# EAGLE design 16n_13 (EAGLE 9.1.3)

## Sheet 1 of 2: Faders / Jacks / Digital
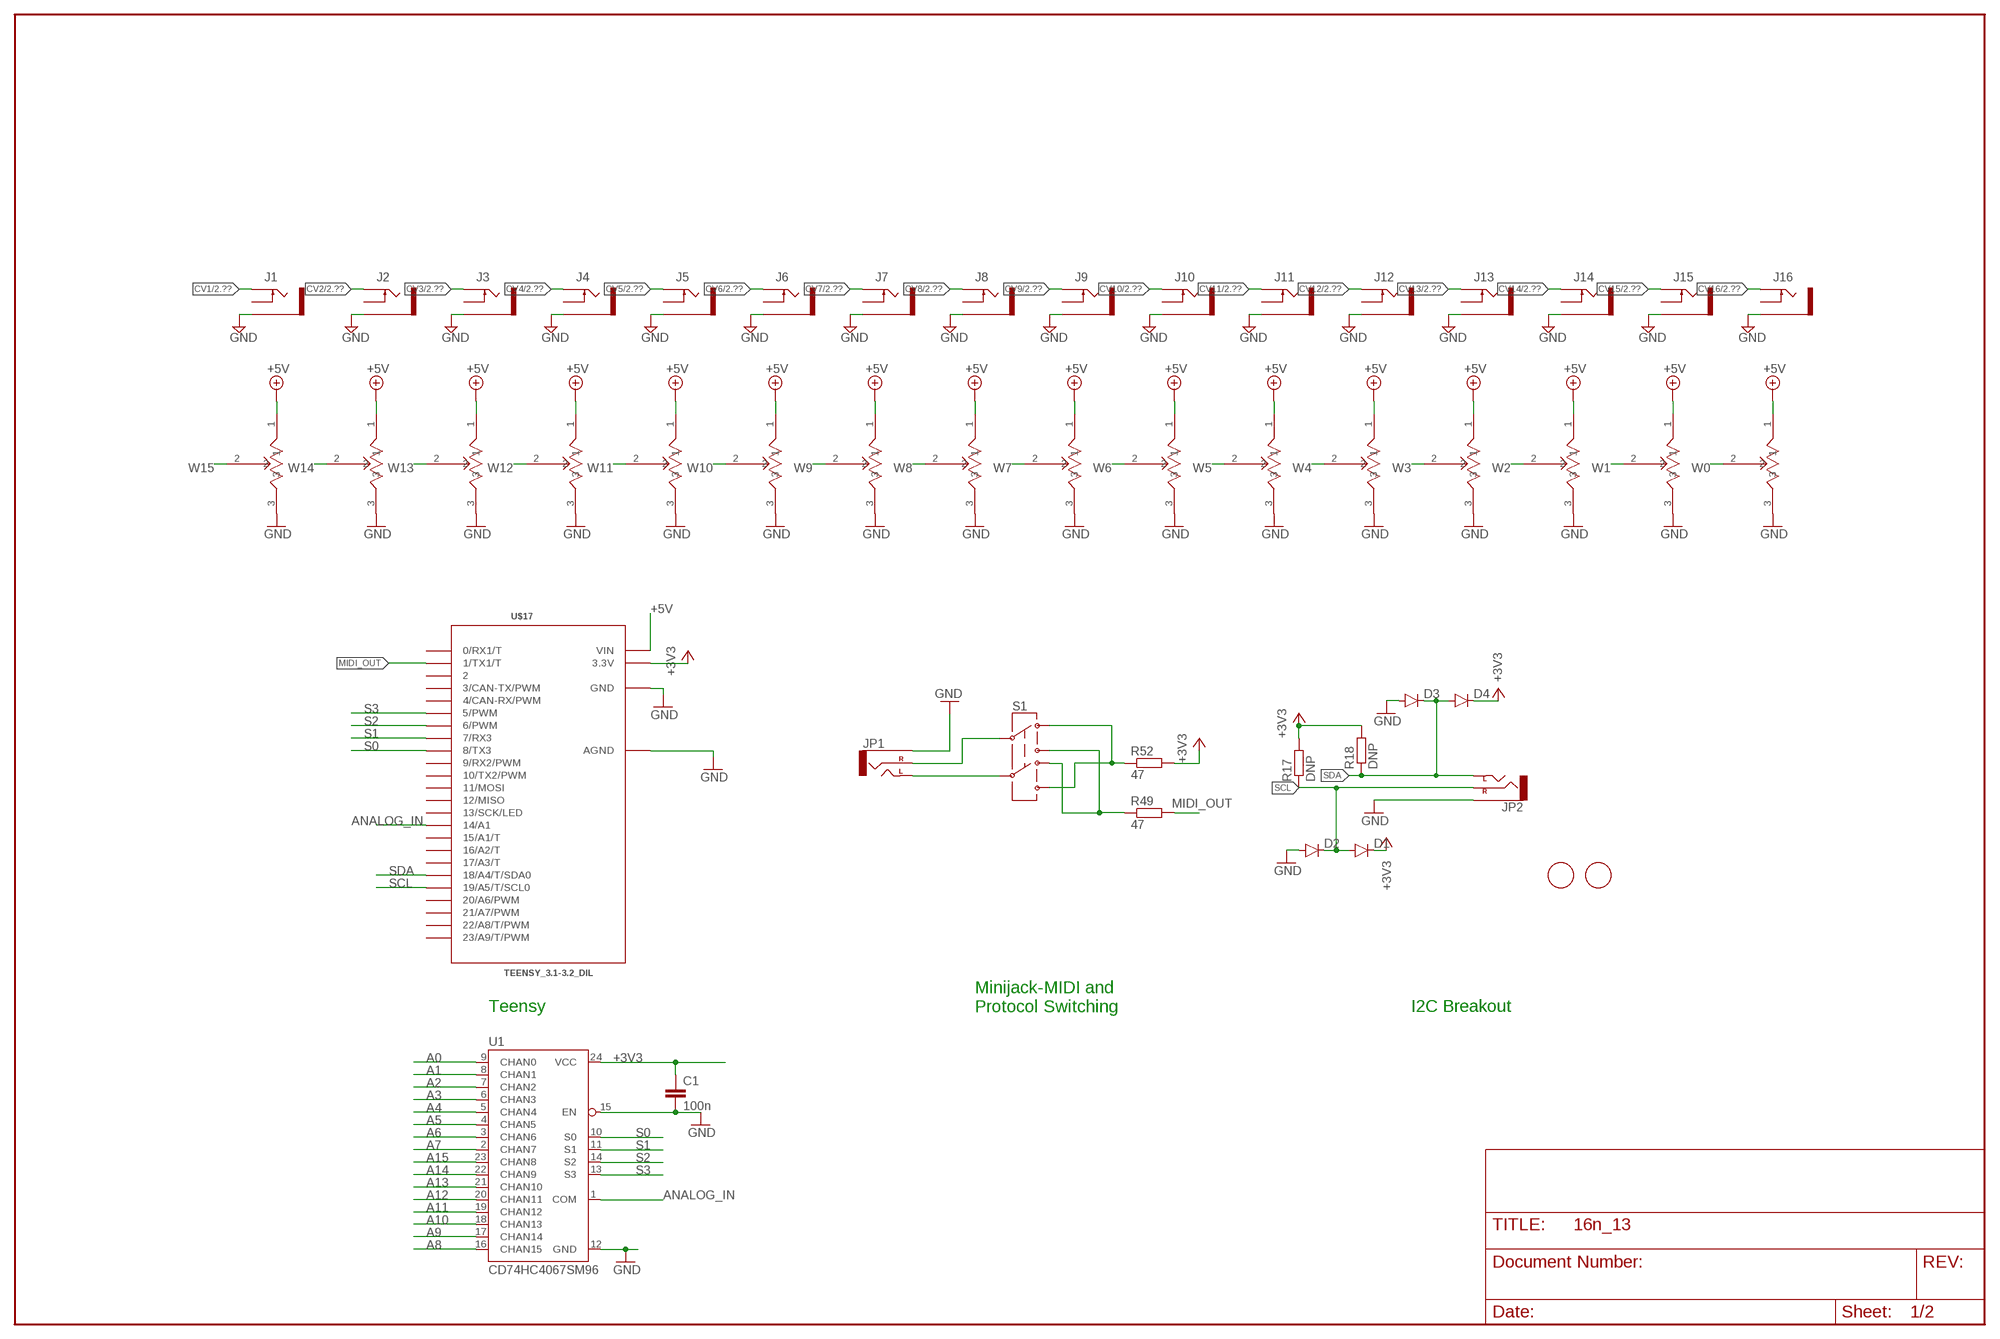
[diagram p0: schematic, sheet 1]

### Parts
C1  100n  C-EUC0805  [C0805]
D1  DIODESOD123  [SOD-123]
D2  DIODESOD123  [SOD-123]
D3  DIODESOD123  [SOD-123]
D4  DIODESOD123  [SOD-123]
FID1  FIDUCIAL  [FIDUCIAL_1MM]
FID2  FIDUCIAL  [FIDUCIAL_1MM]
J1  PJ302M  [PJ302M]
J2  PJ302M  [PJ302M]
J3  PJ302M  [PJ302M]
J4  PJ302M  [PJ302M]
J5  PJ302M  [PJ302M]
J6  PJ302M  [PJ302M]
J7  PJ302M  [PJ302M]
J8  PJ302M  [PJ302M]
J9  PJ302M  [PJ302M]
J10  PJ302M  [PJ302M]
J11  PJ302M  [PJ302M]
J12  PJ302M  [PJ302M]
J13  PJ302M  [PJ302M]
J14  PJ302M  [PJ302M]
J15  PJ302M  [PJ302M]
J16  PJ302M  [PJ302M]
JP1  AUDIO-JACKPTH  [AUDIO-JACK]
JP2  AUDIO-JACKPTH  [AUDIO-JACK]
R17  DNP  R-EU_R0805  [R0805]
R18  DNP  R-EU_R0805  [R0805]
R49  47  R-EU_R0805  [R0805]
R52  47  R-EU_R0805  [R0805]
S1  SWITCH-DPDTEG2211  [EG2211]
U1  CD74HC4067SM96  744067SO24  [SOIC127P1030X265-24]
U$1  SLIDEPOT-ALPS-60MM  [RS6011SP600]
U$2  SLIDEPOT-ALPS-60MM  [RS6011SP600]
U$3  SLIDEPOT-ALPS-60MM  [RS6011SP600]
U$4  SLIDEPOT-ALPS-60MM  [RS6011SP600]
U$5  SLIDEPOT-ALPS-60MM  [RS6011SP600]
U$6  SLIDEPOT-ALPS-60MM  [RS6011SP600]
U$7  SLIDEPOT-ALPS-60MM  [RS6011SP600]
U$8  SLIDEPOT-ALPS-60MM  [RS6011SP600]
U$9  SLIDEPOT-ALPS-60MM  [RS6011SP600]
U$10  SLIDEPOT-ALPS-60MM  [RS6011SP600]
U$11  SLIDEPOT-ALPS-60MM  [RS6011SP600]
U$12  SLIDEPOT-ALPS-60MM  [RS6011SP600]
U$13  SLIDEPOT-ALPS-60MM  [RS6011SP600]
U$14  SLIDEPOT-ALPS-60MM  [RS6011SP600]
U$15  SLIDEPOT-ALPS-60MM  [RS6011SP600]
U$16  SLIDEPOT-ALPS-60MM  [RS6011SP600]
U$17  TEENSY_3.1-3.2_DIL  [TEENSY_3.0-3.2&LC_DIL]

### Nets
+3V3: C1.1 D1.C D4.C R17.2 R18.2 R52.2 U1.24(VCC) U$17.3.3V
+5V: U$1.1 U$2.1 U$3.1 U$4.1 U$5.1 U$6.1 U$7.1 U$8.1 U$9.1 U$10.1 U$11.1 U$12.1 U$13.1 U$14.1 U$15.1 U$16.1 U$17.VIN ; also sheet 2
A0: U1.9(CHAN0) ; also sheet 2
A1: U1.8(CHAN1) ; also sheet 2
A2: U1.7(CHAN2) ; also sheet 2
A3: U1.6(CHAN3) ; also sheet 2
A4: U1.5(CHAN4) ; also sheet 2
A5: U1.4(CHAN5) ; also sheet 2
A6: U1.3(CHAN6) ; also sheet 2
A7: U1.2(CHAN7) ; also sheet 2
A8: U1.16(CHAN15) ; also sheet 2
A9: U1.17(CHAN14) ; also sheet 2
A10: U1.18(CHAN13) ; also sheet 2
A11: U1.19(CHAN12) ; also sheet 2
A12: U1.20(CHAN11) ; also sheet 2
A13: U1.21(CHAN10) ; also sheet 2
A14: U1.22(CHAN9) ; also sheet 2
A15: U1.23(CHAN8) ; also sheet 2
ANALOG_IN: U1.1(COM) U$17.14/A0(14/A1)
CV1: J1.TIP ; also sheet 2
CV2: J2.TIP ; also sheet 2
CV3: J3.TIP ; also sheet 2
CV4: J4.TIP ; also sheet 2
CV5: J5.TIP ; also sheet 2
CV6: J6.TIP ; also sheet 2
CV7: J7.TIP ; also sheet 2
CV8: J8.TIP ; also sheet 2
CV9: J9.TIP ; also sheet 2
CV10: J10.TIP ; also sheet 2
CV11: J11.TIP ; also sheet 2
CV12: J12.TIP ; also sheet 2
CV13: J13.TIP ; also sheet 2
CV14: J14.TIP ; also sheet 2
CV15: J15.TIP ; also sheet 2
CV16: J16.TIP ; also sheet 2
GND: C1.2 D2.A D3.A J1.GND(SLEEVE) J2.GND(SLEEVE) J3.GND(SLEEVE) J4.GND(SLEEVE) J5.GND(SLEEVE) J6.GND(SLEEVE) J7.GND(SLEEVE) J8.GND(SLEEVE) J9.GND(SLEEVE) J10.GND(SLEEVE) J11.GND(SLEEVE) J12.GND(SLEEVE) J13.GND(SLEEVE) J14.GND(SLEEVE) J15.GND(SLEEVE) J16.GND(SLEEVE) JP1.SLEEVE JP2.SLEEVE U1.12(GND) U1.15(EN) U$1.3 U$2.3 U$3.3 U$4.3 U$5.3 U$6.3 U$7.3 U$8.3 U$9.3 U$10.3 U$11.3 U$12.3 U$13.3 U$14.3 U$15.3 U$16.3 U$17.AGND U$17.GND ; also sheet 2
MIDI_OUT: R49.2 U$17.1(1/TX1/T)
N$1: JP1.TIP(LEFT) S1.P2
N$2: JP1.RING(RIGHT) S1.P1
N$3: R49.1 S1.P1-TB S1.P2-TA
N$4: R52.1 S1.P1-TA S1.P2-TB
S0: U1.10(S0) U$17.8(8/TX3)
S1: U1.11(S1) U$17.7(7/RX3)
S2: U1.14(S2) U$17.6(6/PWM)
S3: U1.13(S3) U$17.5(5/PWM)
SCL: D1.A D2.C JP2.RING(RIGHT) R17.1 U$17.19/A5(19/A5/T/SCL0)
SDA: D3.C D4.A JP2.TIP(LEFT) R18.1 U$17.18/A4(18/A4/T/SDA0)
W0: U$1.2 ; also sheet 2
W1: U$2.2 ; also sheet 2
W2: U$3.2 ; also sheet 2
W3: U$4.2 ; also sheet 2
W4: U$5.2 ; also sheet 2
W5: U$6.2 ; also sheet 2
W6: U$7.2 ; also sheet 2
W7: U$8.2 ; also sheet 2
W8: U$9.2 ; also sheet 2
W9: U$10.2 ; also sheet 2
W10: U$11.2 ; also sheet 2
W11: U$12.2 ; also sheet 2
W12: U$13.2 ; also sheet 2
W13: U$14.2 ; also sheet 2
W14: U$15.2 ; also sheet 2
W15: U$16.2 ; also sheet 2
Unconnected: J1.SW(SWITCH) J2.SW(SWITCH) J3.SW(SWITCH) J4.SW(SWITCH) J5.SW(SWITCH) J6.SW(SWITCH) J7.SW(SWITCH) J8.SW(SWITCH) J9.SW(SWITCH) J10.SW(SWITCH) J11.SW(SWITCH) J12.SW(SWITCH) J13.SW(SWITCH) J14.SW(SWITCH) J15.SW(SWITCH) J16.SW(SWITCH) U$17.0(0/RX1/T) U$17.2 U$17.3(3/CAN-TX/PWM) U$17.4(4/CAN-RX/PWM) U$17.9(9/RX2/PWM) U$17.10(10/TX2/PWM) U$17.11(11/MOSI) U$17.12(12/MISO) U$17.13(13/SCK/LED) U$17.15/A1(15/A1/T) U$17.16/A2(16/A2/T) U$17.17/A3(17/A3/T) U$17.20/A6(20/A6/PWM) U$17.21/A7(21/A7/PWM) U$17.22/A8(22/A8/T/PWM) U$17.23/A9(23/A9/T/PWM)

### Notes on the sheet
- Teensy
- Minijack-MIDI and 
  Protocol Switching
- I2C Breakout

## Sheet 2 of 2: Buffers / OpAmp power
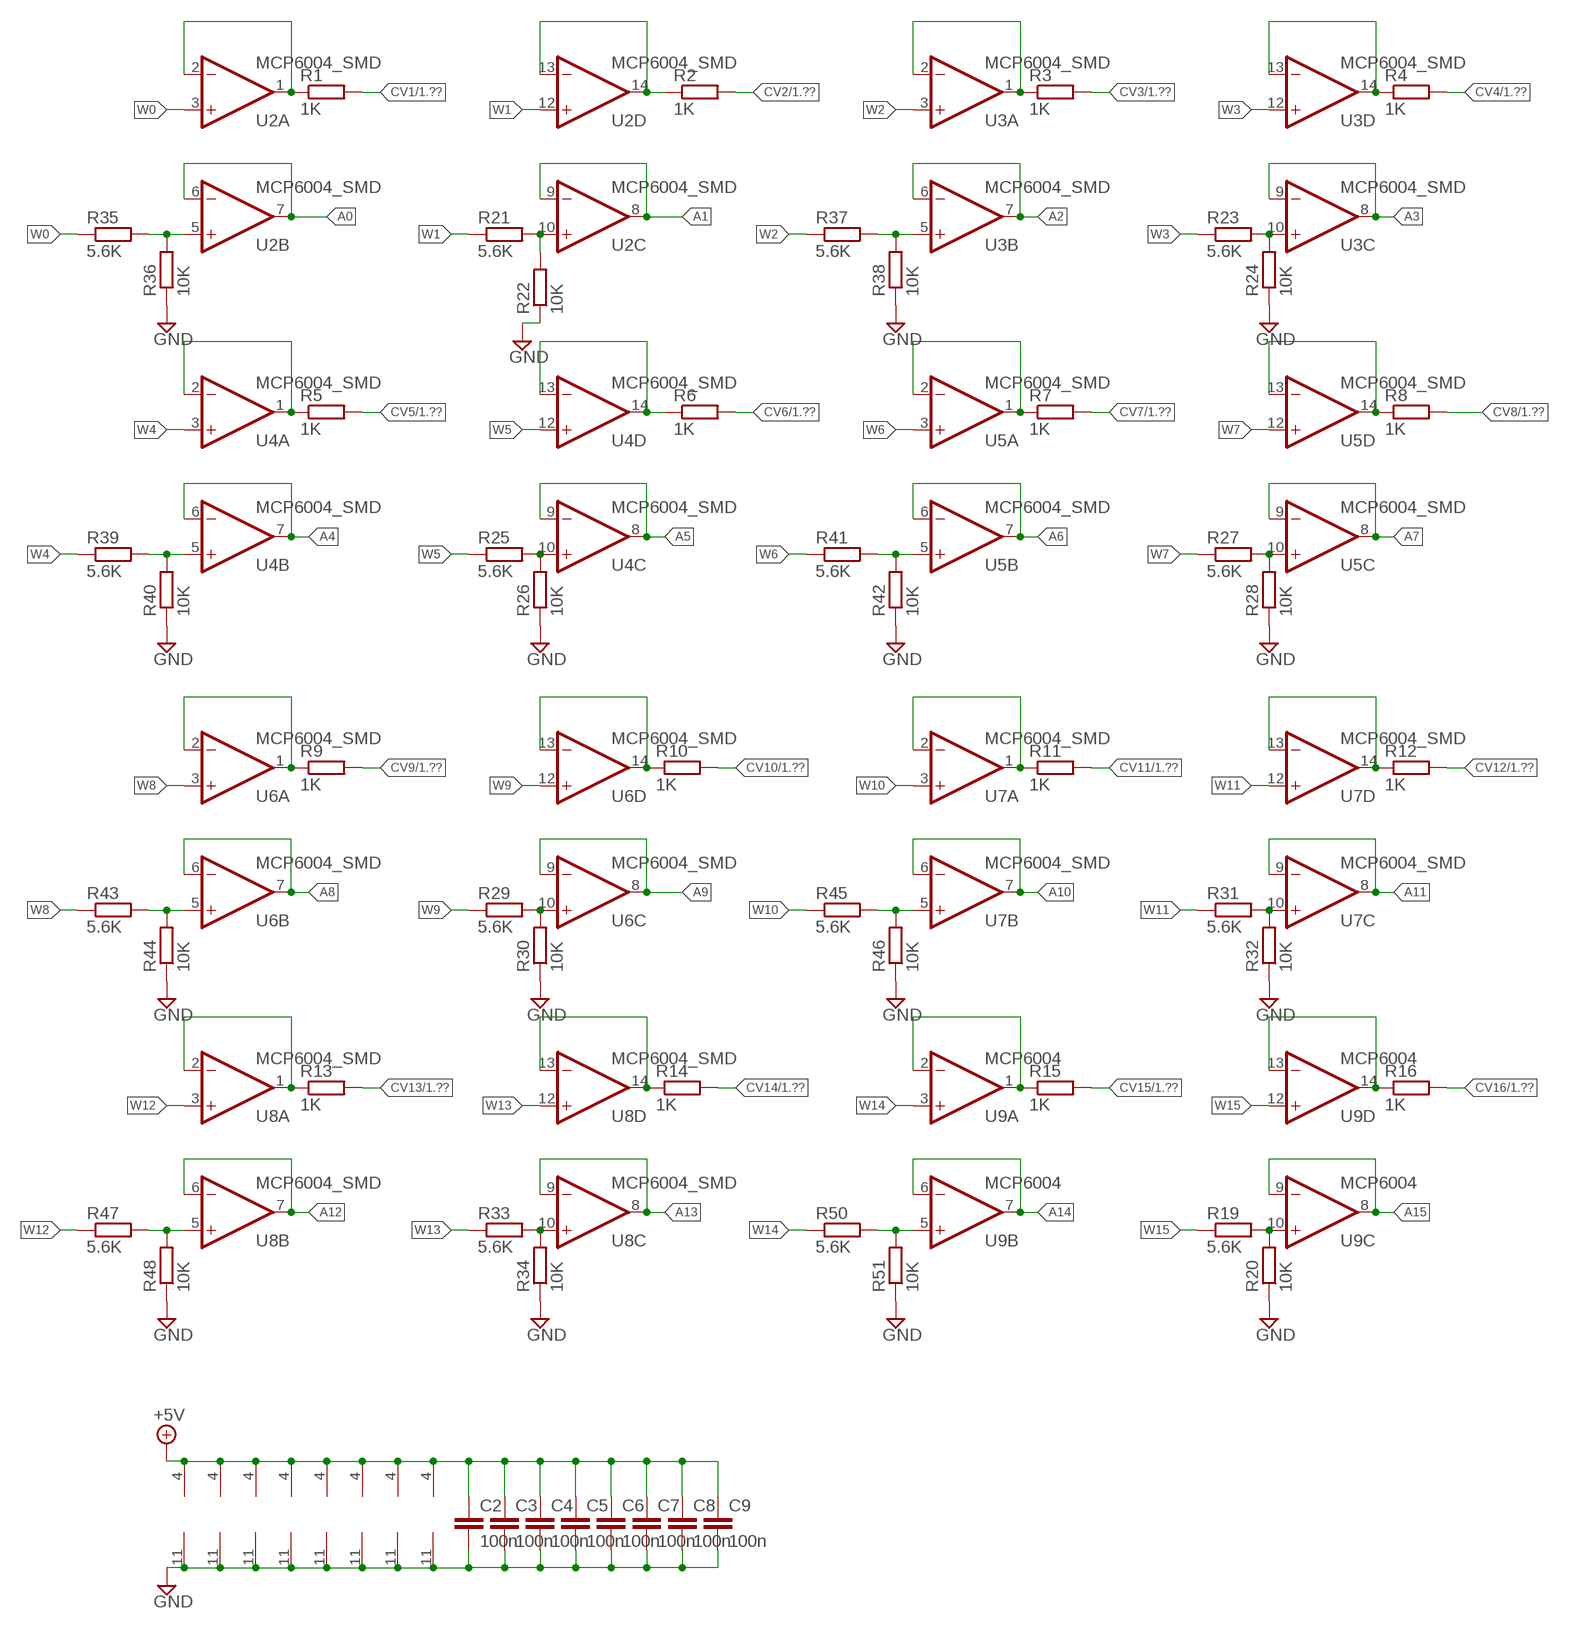
[diagram p1: schematic, sheet 2]

### Parts
C2  100n  C-EUC0805  [C0805]
C3  100n  C-EUC0805  [C0805]
C4  100n  C-EUC0805  [C0805]
C5  100n  C-EUC0805  [C0805]
C6  100n  C-EUC0805  [C0805]
C7  100n  C-EUC0805  [C0805]
C8  100n  C-EUC0805  [C0805]
C9  100n  C-EUC0805  [C0805]
R1  1K  R-EU_R0805  [R0805]
R2  1K  R-EU_R0805  [R0805]
R3  1K  R-EU_R0805  [R0805]
R4  1K  R-EU_R0805  [R0805]
R5  1K  R-EU_R0805  [R0805]
R6  1K  R-EU_R0805  [R0805]
R7  1K  R-EU_R0805  [R0805]
R8  1K  R-EU_R0805  [R0805]
R9  1K  R-EU_R0805  [R0805]
R10  1K  R-EU_R0805  [R0805]
R11  1K  R-EU_R0805  [R0805]
R12  1K  R-EU_R0805  [R0805]
R13  1K  R-EU_R0805  [R0805]
R14  1K  R-EU_R0805  [R0805]
R15  1K  R-EU_R0805  [R0805]
R16  1K  R-EU_R0805  [R0805]
R19  5.6K  R-EU_R0805  [R0805]
R20  10K  R-EU_R0805  [R0805]
R21  5.6K  R-EU_R0805  [R0805]
R22  10K  R-EU_R0805  [R0805]
R23  5.6K  R-EU_R0805  [R0805]
R24  10K  R-EU_R0805  [R0805]
R25  5.6K  R-EU_R0805  [R0805]
R26  10K  R-EU_R0805  [R0805]
R27  5.6K  R-EU_R0805  [R0805]
R28  10K  R-EU_R0805  [R0805]
R29  5.6K  R-EU_R0805  [R0805]
R30  10K  R-EU_R0805  [R0805]
R31  5.6K  R-EU_R0805  [R0805]
R32  10K  R-EU_R0805  [R0805]
R33  5.6K  R-EU_R0805  [R0805]
R34  10K  R-EU_R0805  [R0805]
R35  5.6K  R-EU_R0805  [R0805]
R36  10K  R-EU_R0805  [R0805]
R37  5.6K  R-EU_R0805  [R0805]
R38  10K  R-EU_R0805  [R0805]
R39  5.6K  R-EU_R0805  [R0805]
R40  10K  R-EU_R0805  [R0805]
R41  5.6K  R-EU_R0805  [R0805]
R42  10K  R-EU_R0805  [R0805]
R43  5.6K  R-EU_R0805  [R0805]
R44  10K  R-EU_R0805  [R0805]
R45  5.6K  R-EU_R0805  [R0805]
R46  10K  R-EU_R0805  [R0805]
R47  5.6K  R-EU_R0805  [R0805]
R48  10K  R-EU_R0805  [R0805]
R50  5.6K  R-EU_R0805  [R0805]
R51  10K  R-EU_R0805  [R0805]
U2  MCP6004_SMD  [SO14]
U3  MCP6004_SMD  [SO14]
U4  MCP6004_SMD  [SO14]
U5  MCP6004_SMD  [SO14]
U6  MCP6004_SMD  [SO14]
U7  MCP6004_SMD  [SO14]
U8  MCP6004_SMD  [SO14]
U9  MCP6004  MCP6004_SMD  [SO14]

### Nets
+5V: C2.1 C3.1 C4.1 C5.1 C6.1 C7.1 C8.1 C9.1 U2.4(P:V+) U3.4(P:V+) U4.4(P:V+) U5.4(P:V+) U6.4(P:V+) U7.4(P:V+) U8.4(P:V+) U9.4(P:V+) ; also sheet 1
A0: U2.6(B:-IN) U2.7(B:OUT) ; also sheet 1
A1: U2.8(C:OUT) U2.9(C:-IN) ; also sheet 1
A2: U3.6(B:-IN) U3.7(B:OUT) ; also sheet 1
A3: U3.8(C:OUT) U3.9(C:-IN) ; also sheet 1
A4: U4.6(B:-IN) U4.7(B:OUT) ; also sheet 1
A5: U4.8(C:OUT) U4.9(C:-IN) ; also sheet 1
A6: U5.6(B:-IN) U5.7(B:OUT) ; also sheet 1
A7: U5.8(C:OUT) U5.9(C:-IN) ; also sheet 1
A8: U6.6(B:-IN) U6.7(B:OUT) ; also sheet 1
A9: U6.8(C:OUT) U6.9(C:-IN) ; also sheet 1
A10: U7.6(B:-IN) U7.7(B:OUT) ; also sheet 1
A11: U7.8(C:OUT) U7.9(C:-IN) ; also sheet 1
A12: U8.6(B:-IN) U8.7(B:OUT) ; also sheet 1
A13: U8.8(C:OUT) U8.9(C:-IN) ; also sheet 1
A14: U9.6(B:-IN) U9.7(B:OUT) ; also sheet 1
A15: U9.8(C:OUT) U9.9(C:-IN) ; also sheet 1
CV1: R1.2 ; also sheet 1
CV2: R2.2 ; also sheet 1
CV3: R3.2 ; also sheet 1
CV4: R4.2 ; also sheet 1
CV5: R5.2 ; also sheet 1
CV6: R6.2 ; also sheet 1
CV7: R7.2 ; also sheet 1
CV8: R8.2 ; also sheet 1
CV9: R9.2 ; also sheet 1
CV10: R10.2 ; also sheet 1
CV11: R11.2 ; also sheet 1
CV12: R12.2 ; also sheet 1
CV13: R13.2 ; also sheet 1
CV14: R14.2 ; also sheet 1
CV15: R15.2 ; also sheet 1
CV16: R16.2 ; also sheet 1
GND: C2.2 C3.2 C4.2 C5.2 C6.2 C7.2 C8.2 C9.2 R20.1 R22.1 R24.1 R26.1 R28.1 R30.1 R32.1 R34.1 R36.1 R38.1 R40.1 R42.1 R44.1 R46.1 R48.1 R51.1 U2.11(P:V-) U3.11(P:V-) U4.11(P:V-) U5.11(P:V-) U6.11(P:V-) U7.11(P:V-) U8.11(P:V-) U9.11(P:V-) ; also sheet 1
N$6: R37.2 R38.2 U3.5(B:+IN)
N$7: R23.2 R24.2 U3.10(C:+IN)
N$9: R35.2 R36.2 U2.5(B:+IN)
N$10: R21.2 R22.2 U2.10(C:+IN)
N$12: R39.2 R40.2 U4.5(B:+IN)
N$13: R25.2 R26.2 U4.10(C:+IN)
N$15: R41.2 R42.2 U5.5(B:+IN)
N$16: R27.2 R28.2 U5.10(C:+IN)
N$18: R43.2 R44.2 U6.5(B:+IN)
N$19: R29.2 R30.2 U6.10(C:+IN)
N$21: R45.2 R46.2 U7.5(B:+IN)
N$22: R31.2 R32.2 U7.10(C:+IN)
N$24: R47.2 R48.2 U8.5(B:+IN)
N$25: R33.2 R34.2 U8.10(C:+IN)
N$27: R50.2 R51.2 U9.5(B:+IN)
N$28: R19.2 R20.2 U9.10(C:+IN)
N$300: R1.1 U2.1(A:OUT) U2.2(A:-IN)
N$301: R2.1 U2.13(D:-IN) U2.14(D:OUT)
N$302: R3.1 U3.1(A:OUT) U3.2(A:-IN)
N$303: R4.1 U3.13(D:-IN) U3.14(D:OUT)
N$304: R5.1 U4.1(A:OUT) U4.2(A:-IN)
N$305: R6.1 U4.13(D:-IN) U4.14(D:OUT)
N$306: R7.1 U5.1(A:OUT) U5.2(A:-IN)
N$307: R8.1 U5.13(D:-IN) U5.14(D:OUT)
N$308: R9.1 U6.1(A:OUT) U6.2(A:-IN)
N$309: R10.1 U6.13(D:-IN) U6.14(D:OUT)
N$310: R11.1 U7.1(A:OUT) U7.2(A:-IN)
N$311: R12.1 U7.13(D:-IN) U7.14(D:OUT)
N$312: R13.1 U8.1(A:OUT) U8.2(A:-IN)
N$313: R14.1 U8.13(D:-IN) U8.14(D:OUT)
N$314: R15.1 U9.1(A:OUT) U9.2(A:-IN)
N$315: R16.1 U9.13(D:-IN) U9.14(D:OUT)
W0: R35.1 U2.3(A:+IN) ; also sheet 1
W1: R21.1 U2.12(D:+IN) ; also sheet 1
W2: R37.1 U3.3(A:+IN) ; also sheet 1
W3: R23.1 U3.12(D:+IN) ; also sheet 1
W4: R39.1 U4.3(A:+IN) ; also sheet 1
W5: R25.1 U4.12(D:+IN) ; also sheet 1
W6: R41.1 U5.3(A:+IN) ; also sheet 1
W7: R27.1 U5.12(D:+IN) ; also sheet 1
W8: R43.1 U6.3(A:+IN) ; also sheet 1
W9: R29.1 U6.12(D:+IN) ; also sheet 1
W10: R45.1 U7.3(A:+IN) ; also sheet 1
W11: R31.1 U7.12(D:+IN) ; also sheet 1
W12: R47.1 U8.3(A:+IN) ; also sheet 1
W13: R33.1 U8.12(D:+IN) ; also sheet 1
W14: R50.1 U9.3(A:+IN) ; also sheet 1
W15: R19.1 U9.12(D:+IN) ; also sheet 1

## Library data of the parts
C1-C9 = rcl:C-EU: CAPACITOR, European symbol; SPICEPREFIX: C
D1-D4 = foxfield:DIODE
FID1 FID2 = adafruit:FIDUCIAL: For use by pick and place machines to calibrate the vision/machine, 1mm By microbuilder.eu
J1-J16 = pj302m:PJ302M: PJ302M horizontal / right angled mount 3.5 mm jack socket
JP1 JP2 = SparkFun-Connectors:AUDIO-JACK: 3.5mm Audio Jack Simple 3.5mm common PCB mount audio jack. Variant PTH is our storefront SKU PRT-08032
R1-R52 = rcl:R-EU_: RESISTOR, European symbol
S1 = SparkFun-Electromechanical:SWITCH-DPDT: DPDT Version of the COM-00597
U1 = foxfield:74*4067: 16-channel analog MUX Datasheet <http://www.sparkfun.com/datasheets/IC/cd74hc4067.pdf> SparkFun Products MP3 Trigger <https://www.sparkfun.com/products/13720> (WIG-13720) SparkFun Analog/Digital MUX Breakout - CD74HC4067 <https://www.sparkfun.com/products/9056> (BOB-09056)
U2-U9 = MusicThingModular:MCP6004: Generic Quad Op Amp
U$1-U$16 = monome:SLIDEPOT-ALPS-60MM
U$17 = Teensy_3_and_LC_Series_Boards_v1.4:TEENSY_3.1-3.2_DIL: Teensy 3.1 or 3.2 in a DIL Layout.

## Board
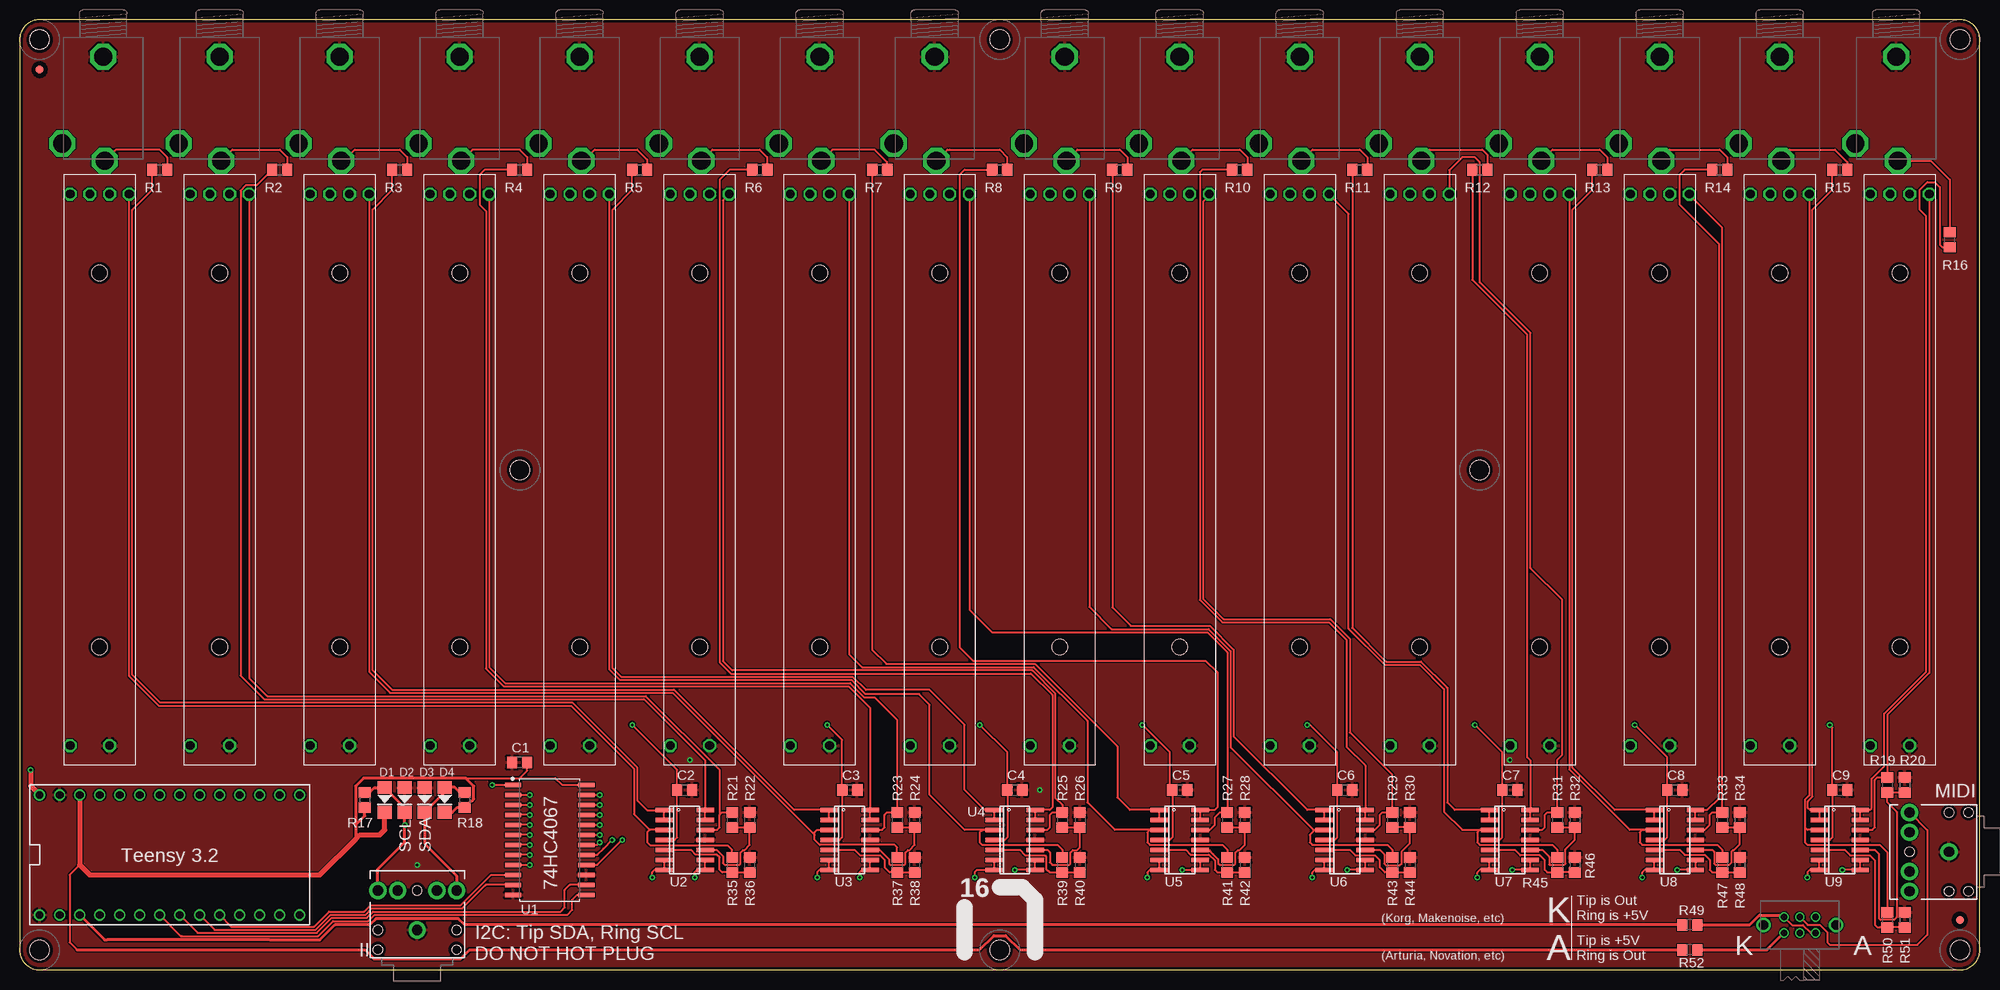
[diagram p2: board, top side]
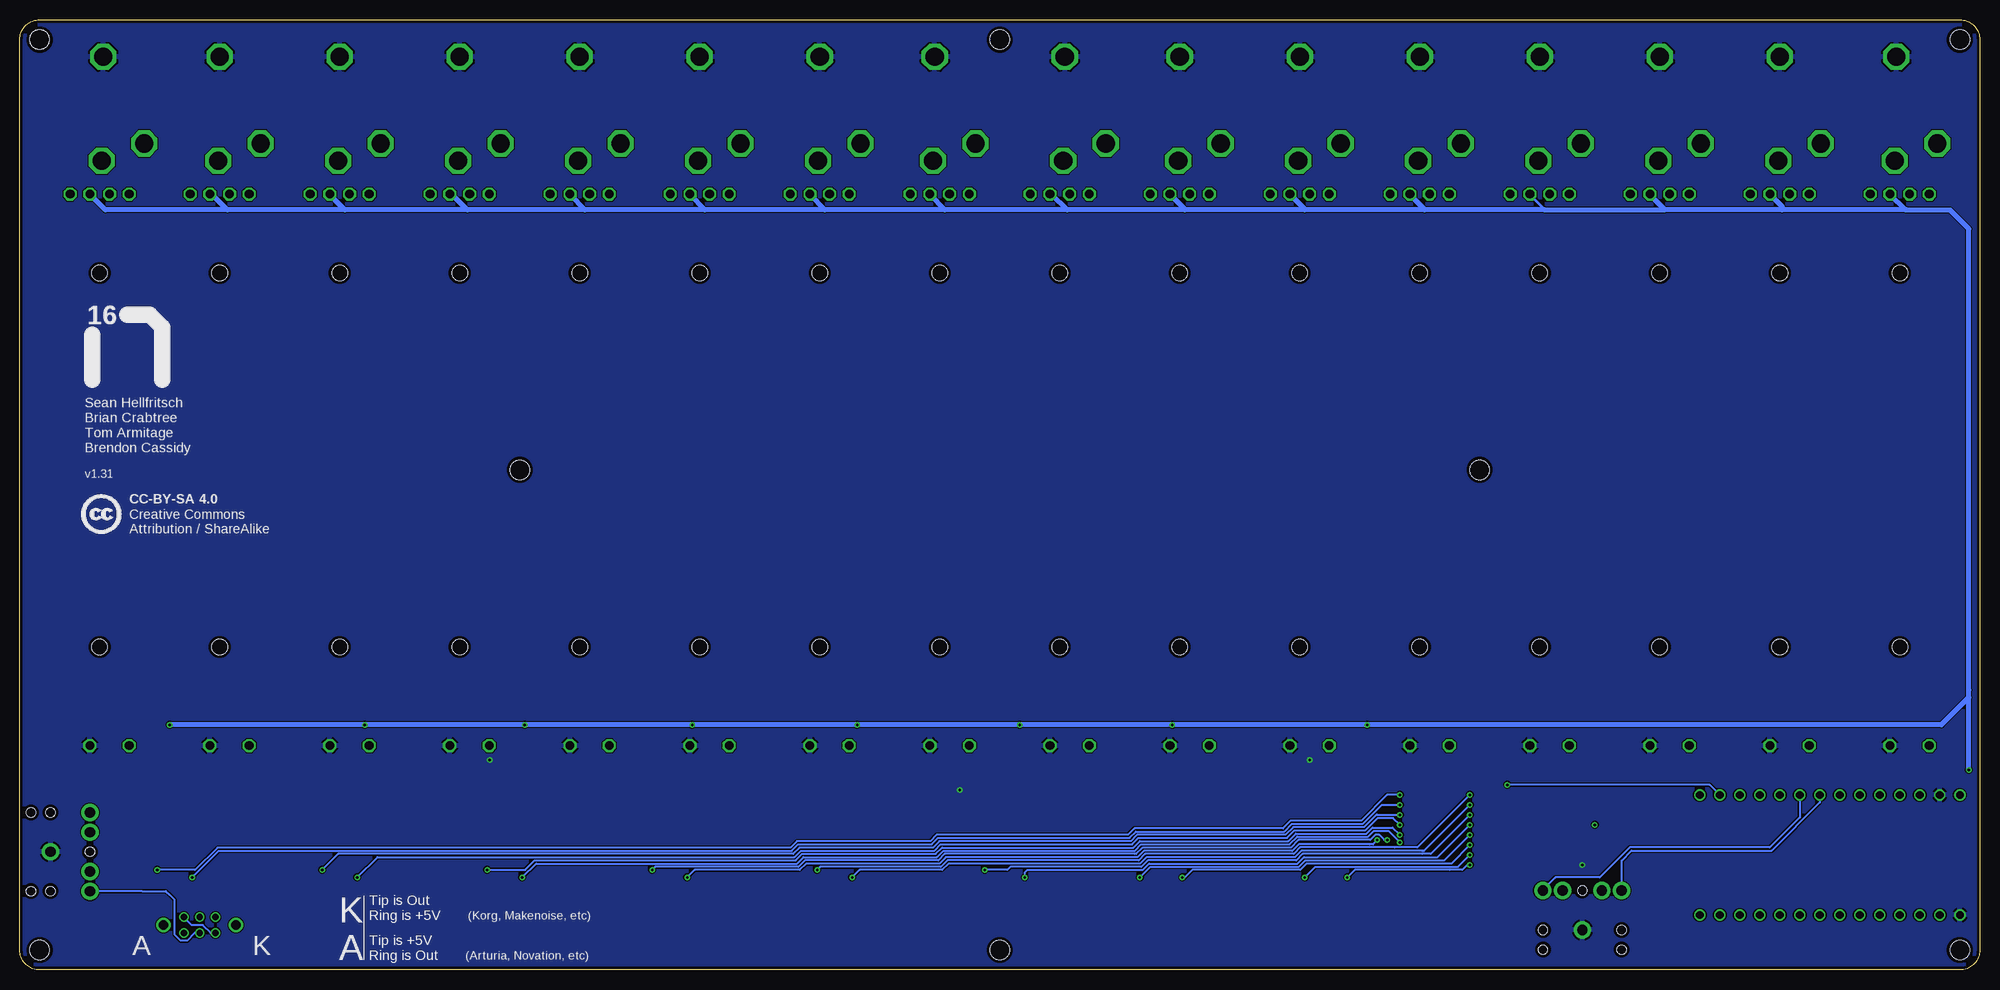
[diagram p3: board, bottom side, seen from below]

Size 248.92 x 120.65 mm. Coordinates in mm from the lower left corner, seen from the top.
Outline: 2.54,0 246.38,0 arc90 248.92,2.54 248.92,118.11 arc90 246.38,120.65 2.54,120.65 arc90 0,118.11 0,2.54 arc90 2.54,0
Copper layers (1*16): Top 0.0356mm / dielectric 1.5011mm / Bottom 0.0356mm
Design rules "oshpark-2layer": minimum track width 6mil, minimum drill 13mil, track to track 6mil, track to pad 6mil, pad to pad 6mil, via to via 6mil, smd to smd 6mil, copper to edge 15mil, drill to drill 6mil, minimum pad ring 7mil, minimum via ring 7mil, stop-mask expansion 2.5mil, vias tented up to drill 0mil, thermal gap 10mil
Holes 2.5 mm at 2.54,2.54 246.38,2.54 2.54,118.11 246.38,118.11 63.5,63.5 185.42,63.5 124.46,2.54 124.46,118.11

### Footprints (pad centres in the part's own frame; a part is rotated, then mirrored left to right if it is on the bottom)
C0805 = smd 1.3 x 1.5: 1 -0.95,0; 2 0.95,0
SOD-123 = smd 1.6 x 1.8: A 1.575,0; C -1.575,0
FIDUCIAL_1MM = smd 1 x 1: 1 0,0
PJ302M = drill 2.3 pad 3.3 octagon: GND 2.5,0; SW 13.5,-5.2; TIP 15.7,0.2
AUDIO-JACK = drill 1.3 pad 2.184: RING 5,5; RSH 5,2.5; SLEEVE 0,0; TIP 5,-5; TSH 5,-2.5 | hole 1.2: 0,5; -2.5,5; -2.5,-5; 0,-5; 5,0
R0805 = smd 1.3 x 1.5: 1 -0.95,0; 2 0.95,0
EG2211 = drill 0.8: P1 -1,0; P1-TA -1,2; P1-TB -1,-2; P2 1,0; P2-TA 1,2; P2-TB 1,-2 | drill 1.2: P$7 0,4.6; P$8 0,-4.6
SOIC127P1030X265-24 = smd 2.056 x 0.602: 1 -4.642,6.985; 2 -4.642,5.715; 3 -4.642,4.445; 4 -4.642,3.175; 5 -4.642,1.905; 6 -4.642,0.635; 7 -4.642,-0.635; 8 -4.642,-1.905; 9 -4.642,-3.175; 10 -4.642,-4.445; 11 -4.642,-5.715; 12 -4.642,-6.985; 13 4.642,-6.985; 14 4.642,-5.715; 15 4.642,-4.445; 16 4.642,-3.175; 17 4.642,-1.905; 18 4.642,-0.635; 19 4.642,0.635; 20 4.642,1.905; 21 4.642,3.175; 22 4.642,4.445; 23 4.642,5.715; 24 4.642,6.985
SO14 = smd 0.6 x 2.2: 1 -3.81,-2.6; 2 -2.54,-2.6; 3 -1.27,-2.6; 4 0,-2.6; 5 1.27,-2.6; 6 2.54,-2.6; 7 3.81,-2.6; 8 3.81,2.6; 9 2.54,2.6; 10 1.27,2.6; 11 0,2.6; 12 -1.27,2.6; 13 -2.54,2.6; 14 -3.81,2.6
RS6011SP600 = drill 1.1 octagon: 1 -35,1.25; 2 -35,3.75; 3 35,1.25; L1 35,-3.75; L2 -35,-3.75; L3 -35,-1.25 | hole 2: -25,0; 22.5,0
TEENSY_3.0-3.2&LC_DIL = drill 0.965: 0 -7.62,13.97; 1 -7.62,11.43; 2 -7.62,8.89; 3 -7.62,6.35; 3.3V 7.62,11.43; 4 -7.62,3.81; 5 -7.62,1.27; 6 -7.62,-1.27; 7 -7.62,-3.81; 8 -7.62,-6.35; 9 -7.62,-8.89; 10 -7.62,-11.43; 11 -7.62,-13.97; 12 -7.62,-16.51; 13 7.62,-16.51; 14/A0 7.62,-13.97; 15/A1 7.62,-11.43; 16/A2 7.62,-8.89; 17/A3 7.62,-6.35; 18/A4 7.62,-3.81; 19/A5 7.62,-1.27; 20/A6 7.62,1.27; 21/A7 7.62,3.81; 22/A8 7.62,6.35; 23/A9 7.62,8.89; AGND 7.62,13.97; GND -7.62,16.51; VIN 7.62,16.51

### Placement (x,y rotation side)
C1  63.5,26.35 180 top
C2  84.44,22.86 0 top
C3  105.41,22.86 0 top
C4  126.36,22.86 0 top
C5  147.32,22.86 0 top
C6  168.28,22.86 0 top
C7  189.23,22.86 0 top
C8  210.19,22.86 0 top
C9  231.14,22.86 0 top
D1  46.35,21.59 90 top
D2  48.9,21.59 90 top
D3  51.44,21.59 90 top
D4  53.98,21.59 90 top
FID1  2.54,114.3 0 top
FID2  246.38,6.35 0 top
J1  10.6,118.43 270 top
J2  25.4,118.43 270 top
J3  40.64,118.43 270 top
J4  55.88,118.43 270 top
J5  71.12,118.43 270 top
J6  86.36,118.43 270 top
J7  101.6,118.43 270 top
J8  116.2,118.43 270 top
J9  132.72,118.43 270 top
J10  147.32,118.43 270 top
J11  162.56,118.43 270 top
J12  177.8,118.43 270 top
J13  193.04,118.43 270 top
J14  208.28,118.43 270 top
J15  223.52,118.43 270 top
J16  238.3,118.43 270 top
JP1  245,15 180 top
JP2  50.48,5.08 90 top
R1  17.78,101.6 0 top
R2  33.02,101.6 0 top
R3  48.26,101.6 0 top
R4  63.5,101.6 0 top
R5  78.74,101.6 0 top
R6  93.98,101.6 0 top
R7  109.22,101.6 0 top
R8  124.46,101.6 0 top
R9  139.7,101.6 0 top
R10  154.94,101.6 0 top
R11  170.18,101.6 0 top
R12  185.42,101.6 0 top
R13  200.66,101.6 0 top
R14  215.9,101.6 0 top
R15  231.14,101.6 0 top
R16  245.11,92.71 90 top
R17  43.81,21.59 270 top
R18  56.52,21.59 270 top
R19  237.17,23.5 270 top
R20  239.4,23.5 270 top
R21  90.49,19.05 270 top
R22  92.71,19.05 270 top
R23  111.44,19.05 270 top
R24  113.67,19.05 270 top
R25  132.4,19.05 270 top
R26  134.62,19.05 270 top
R27  153.35,19.05 270 top
R28  155.57,19.05 270 top
R29  174.31,19.05 270 top
R30  176.53,19.05 270 top
R31  195.26,19.05 270 top
R32  197.49,19.05 270 top
R33  216.22,19.05 270 top
R34  218.44,19.05 270 top
R35  90.49,13.34 270 top
R36  92.71,13.34 270 top
R37  111.44,13.34 270 top
R38  113.67,13.34 270 top
R39  132.4,13.34 270 top
R40  134.62,13.34 270 top
R41  153.35,13.34 270 top
R42  155.57,13.34 270 top
R43  174.31,13.34 270 top
R44  176.53,13.34 270 top
R45  195.26,13.34 270 top
R46  197.49,13.34 270 top
R47  216.22,13.34 270 top
R48  218.44,13.34 270 top
R49  212.09,5.71 180 top
R50  237.17,6.35 270 top
R51  239.4,6.35 270 top
R52  212.09,2.54 180 top
S1  226.06,5.71 90 top
U1  67.31,16.51 0 top
U2  84.45,16.51 270 top
U3  105.41,16.51 270 top
U4  126.36,16.51 270 top
U5  147.32,16.51 270 top
U6  168.28,16.51 270 top
U7  189.23,16.51 270 top
U8  210.19,16.51 270 top
U9  231.14,16.51 270 top
U$1  10.16,63.5 270 top
U$2  25.4,63.5 270 top
U$3  40.64,63.5 270 top
U$4  55.88,63.5 270 top
U$5  71.12,63.5 270 top
U$6  86.36,63.5 270 top
U$7  101.6,63.5 270 top
U$8  116.84,63.5 270 top
U$9  132.08,63.5 270 top
U$10  147.32,63.5 270 top
U$11  162.56,63.5 270 top
U$12  177.8,63.5 270 top
U$13  193.04,63.5 270 top
U$14  208.28,63.5 270 top
U$15  223.52,63.5 270 top
U$16  238.76,63.5 270 top
U$17  19.05,14.61 90 top

### Tracks (layer width: path | path; a pad name or v marks a point on that pad's centre or on a via)
+3V3
  Top 0.254: 56.2,24.37 63.5,24.37 | 63.5,24.37 68.02,24.37 68.9,23.5 U1.24 | 7.62,13.34 6.35,12.06 6.35,3.49 7.3,2.54 | 63.5,24.37 64.45,25.32 C1.1
  Top 0.406: D4.C 54.94,20.02 55.56,20.64 R18.2 57.36,21.48 57.43,21.48 57.67,21.72 57.67,23.36 56.66,24.37 56.2,24.37 43.67,24.37 42.66,23.36 42.66,18.41 | 7.3,2.54 43.85,2.54 44.99,1.4 55.97,1.4 57.12,2.54 121.87,2.54 123.7,4.37 125.22,4.37 127.05,2.54 R52.2 | 42.66,18.41 42.66,16.71 42.7,16.67 | 42.66,18.41 43.81,19.57 R17.2
  Top 0.61: D1.C 46.35,17.78 45.72,17.14 43.18,17.14 42.7,16.67 38.1,12.06 8.89,12.06 7.62,13.34 U$17.3.3V
+5V  (via drill 0.35)
  Top 0.254: v229.87,31.11 230.19,30.8 C9.1 230.19,16.83 229.87,16.51 U9.4 | v205.1,31.11 209.24,26.98 C8.1 209.24,16.83 208.91,16.51 U8.4 | v184.78,31.11 188.28,27.62 C7.1 188.28,16.83 187.96,16.51 U7.4 | v163.51,31.11 163.83,31.11 167.32,27.62 C6.1 167.32,16.83 167,16.51 U6.4 | v142.56,31.11 146.05,27.62 146.05,23.18 C5.1 146.37,16.83 146.05,16.51 U5.4 | v121.92,31.11 125.42,27.62 C4.1 125.42,16.83 125.09,16.51 U4.4 | v102.55,31.11 104.46,29.21 C3.1 104.46,16.83 104.14,16.51 U3.4 | v77.79,31.11 83.5,25.41 C2.1 83.5,16.84 83.5,16.83 83.19,16.51 U2.4
  Top 0.61: 1.39,23.37 1.59,23.18 | v1.39,25.4 1.39,23.37 | 1.39,23.37 1.59,23.18 | U$17.VIN 1.59,23.18
  Bottom 0.406: U$4.1 57.13,98.41 55.24,96.52
  Bottom 0.61: v1.39,25.4 1.39,34.61 | 1.39,34.61 1.39,35.56 1.39,94.1 3.81,96.52 9.21,96.52 | 207.65,96.52 222.57,96.52 | 192.09,96.52 207.65,96.52 | 177.16,96.52 192.09,96.52 | 161.93,96.52 177.16,96.52 | 146.69,96.52 161.93,96.52 | 131.44,96.52 146.69,96.52 | 115.89,96.52 131.44,96.52 | 100.97,96.52 115.89,96.52 | 85.72,96.52 100.97,96.52 | 70.48,96.52 85.72,96.52 | 40.01,96.52 55.24,96.52 70.48,96.52 | 25.08,96.52 40.01,96.52 | 9.21,96.52 25.08,96.52 | 222.57,96.52 238.03,96.52 U$16.1 | U$15.1 224.55,98.5 222.57,96.52 | U$14.1 209.53,98.41 207.65,96.52 | U$13.1 194.07,98.5 192.09,96.52 | U$12.1 179.05,98.41 177.16,96.52 | U$11.1 163.81,98.41 161.93,96.52 | U$10.1 148.57,98.41 146.69,96.52 | U$9.1 133.33,98.41 131.44,96.52 | U$8.1 117.87,98.5 115.89,96.52 | U$7.1 100.97,96.61 100.97,96.52 | U$6.1 85.72,96.61 85.72,96.52 | U$5.1 72.37,98.41 70.48,96.52 | U$3.1 41.89,98.41 40.01,96.52 | U$2.1 25.08,96.93 25.08,96.52 | U$1.1 9.43,96.52 9.21,96.52 | 1.39,34.61 4.89,31.11 v77.79,31.11 v102.55,31.11 v121.92,31.11 v142.56,31.11 v163.51,31.11 v184.78,31.11 v205.1,31.11 v229.87,31.11
A0  (via drill 0.35)
  Top 0.254: v80.33,11.75 80.33,12.38 80.64,12.7 U2.7 U2.6 | U1.9 v64.77,13.34
  Bottom 0.254: v80.33,11.75 79.38,12.7 67.31,12.7 65.72,12.7 65.09,13.34 v64.77,13.34
A1  (via drill 0.35)
  Top 0.254: v85.72,11.75 85.72,12.38 86.04,12.7 U2.8 U2.9 | v64.77,14.61 U1.8
  Bottom 0.254: v85.72,11.75 84.37,13.11 66.27,13.11 v64.77,14.61
A2  (via drill 0.35)
  Top 0.254: v101.28,11.75 101.28,12.38 101.6,12.7 U3.7 U3.6 | v64.77,15.88 U1.7
  Bottom 0.254: v101.28,11.75 100.97,11.75 100.01,12.7 86.3,12.7 85.49,13.51 72.07,13.51 69.67,13.51 67.13,13.51 v64.77,15.88
A3  (via drill 0.35)
  Top 0.254: v106.68,11.75 106.68,12.38 107,12.7 U3.8 U3.9 | v64.77,17.14 U1.6
  Bottom 0.254: v106.68,11.75 105.32,13.11 86.47,13.11 85.66,13.92 68,13.92 v64.77,17.14
A4  (via drill 0.35)
  Top 0.254: v64.77,18.41 U1.5 | v121.28,11.75 121.28,12.38 121.6,12.7 U4.7 U4.6
  Bottom 0.254: v64.77,18.41 68.86,14.33 85.83,14.33 86.64,13.51 105.49,13.51 106.3,12.7 120.97,12.7 121.28,12.38 v121.28,11.75
A5  (via drill 0.35)
  Top 0.254: v64.77,19.68 U1.4 | U4.9 U4.8 v126.36,12.7
  Bottom 0.254: v126.36,12.7 123.51,12.7 123.1,13.11 106.47,13.11 105.66,13.92 86.81,13.92 85.99,14.73 70.8,14.73 69.72,14.73 v64.77,19.68
A6  (via drill 0.35)
  Top 0.254: v143.19,11.75 143.19,12.38 143.51,12.7 U5.7 U5.6 | U1.3 v64.77,20.95
  Bottom 0.254: 70.8,15.14 70.67,15.14 70.8,15.14 | 70.8,15.14 86.16,15.14 86.97,14.33 90.49,14.33 105.83,14.33 106.64,13.51 130.95,13.51 131.76,12.7 142.24,12.7 v143.19,11.75 | v64.77,20.95 70.59,15.14 70.8,15.14
A7  (via drill 0.35)
  Top 0.254: U1.2 v64.77,22.23 | U5.9 U5.8 v147.64,12.7
  Bottom 0.254: 87.13,14.74 86.97,14.9 86.32,15.56 74.3,15.56 | 74.3,15.56 71.44,15.56 v64.77,22.23 | v147.64,12.7 147.23,13.11 131.93,13.11 131.12,13.92 106.81,13.92 105.99,14.73 87.14,14.73 87.13,14.74 | 87.13,14.74 | 74.3,15.56
A8  (via drill 0.35)
  Top 0.254: v164.15,11.75 164.15,12.38 164.47,12.7 U6.7 U6.6 | U1.16 73.34,13.34 v76.52,16.51
  Bottom 0.254: v164.15,11.75 163.19,12.7 149.86,12.7 149.05,13.51 132.1,13.51 131.29,14.33 106.98,14.33 106.16,15.14 87.31,15.14 86.49,15.96 77.47,15.96 77.06,15.96 v76.52,16.51
A9  (via drill 0.35)
  Top 0.254: U1.17 73.34,14.61 74.14,15.4 v75.25,16.51 | U6.9 U6.8 v168.59,12.7
  Bottom 0.254: v168.59,12.7 168.19,13.11 150.03,13.11 149.22,13.92 132.27,13.92 131.46,14.73 107.31,14.73 107.14,14.73 106.33,15.54 87.48,15.54 86.52,16.51 77.41,16.51 76.78,17.14 76.26,17.14 75.62,16.51 v75.25,16.51
A10  (via drill 0.35)
  Top 0.254: v185.1,11.75 185.1,12.38 185.42,12.7 U7.7 U7.6 | U1.18 73.34,15.88 v73.66,16.19
  Bottom 0.254: v185.1,11.75 183.34,13.51 150.2,13.51 149.38,14.33 132.44,14.33 131.62,15.14 107.31,15.14 106.5,15.95 87.65,15.95 86.68,16.92 77.7,16.92 76.95,17.66 75.13,17.66 v73.66,16.19
A11  (via drill 0.35)
  Top 0.254: U1.19 v73.66,17.14 | U7.9 U7.8 v189.55,12.7
  Bottom 0.254: v189.55,12.7 184.72,12.7 183.51,13.92 150.37,13.92 149.55,14.73 132.6,14.73 131.79,15.54 107.48,15.54 106.67,16.36 87.82,16.36 86.85,17.32 77.87,17.32 77.12,18.07 74.58,18.07 v73.66,17.14
A12  (via drill 0.35)
  Top 0.254: v206.06,11.75 206.06,12.38 206.38,12.7 U8.7 U8.6 | U1.20 v73.66,18.41
  Bottom 0.254: v206.06,11.75 203.48,14.33 150.53,14.33 149.72,15.14 132.77,15.14 131.96,15.95 107.65,15.95 106.84,16.76 87.98,16.76 87.02,17.73 78.03,17.73 76.49,19.28 74.52,19.28 v73.66,18.41
A13  (via drill 0.35)
  Top 0.254: U1.21 v73.66,19.68 | U8.9 U8.8 v210.5,12.7
  Bottom 0.254: v210.5,12.7 208.47,14.73 150.7,14.73 149.89,15.54 132.94,15.54 132.13,16.36 107.82,16.36 107,17.17 88.15,17.17 87.19,18.14 78.2,18.14 76.65,19.68 | v73.66,19.68 74.93,19.68 76.52,19.68 | 76.65,19.68 76.52,19.68 | 76.52,19.68 76.65,19.68
A14  (via drill 0.35)
  Top 0.254: v227.01,11.75 227.01,12.38 227.33,12.7 U9.7 U9.6 | U1.22 v73.66,20.95
  Bottom 0.254: v227.01,11.75 223.62,15.14 150.87,15.14 150.06,15.95 133.11,15.95 132.3,16.76 107.99,16.76 107.17,17.58 88.32,17.58 87.36,18.54 78.37,18.54 75.96,20.95 v73.66,20.95
A15  (via drill 0.35)
  Top 0.254: U1.23 v73.66,22.23 | U9.9 U9.8 v231.46,12.7
  Bottom 0.254: v231.46,12.7 226.63,12.7 223.79,15.54 151.04,15.54 150.23,16.36 133.28,16.36 132.47,17.17 108.15,17.17 107.34,17.98 88.49,17.98 87.53,18.95 78.74,18.95 | v73.66,22.23 75.26,22.23 78.54,18.95 | 78.54,18.95 78.74,18.95 | 78.54,18.95 78.74,18.95
ANALOG_IN  (via drill 0.35)
  Top 0.254: v60.01,23.5 U1.1
  Bottom 0.254: U$17.14/A0 34.29,23.5 v60.01,23.5
CV1
  Top 0.254: R1.2 18.73,103.19 17.78,104.14 12.21,104.14 J1.TIP
CV2
  Top 0.254: J2.TIP 27.01,104.14 33.02,104.14 33.97,103.19 R2.2
CV3
  Top 0.254: J3.TIP 41.13,102.73 42.55,104.14 48.26,104.14 49.21,103.19 R3.2
CV4
  Top 0.254: J4.TIP 57.49,104.14 63.5,104.14 64.45,103.19 R4.2
CV5
  Top 0.254: J5.TIP 71.61,102.73 73.03,104.14 78.42,104.14 79.69,102.87 R5.2
CV6
  Top 0.254: J6.TIP 87.97,104.14 93.98,104.14 94.93,103.19 94.93,102.55 R6.2
CV7
  Top 0.254: J7.TIP 103.21,104.14 108.58,104.14 110.17,102.56 R7.2
CV8
  Top 0.254: R8.2 125.41,103.19 124.46,104.14 118.11,104.14 117.82,104.14 J8.TIP
CV9
  Top 0.254: R9.2 140.65,103.19 139.7,104.14 134.3,104.14 132.91,102.75 J9.TIP
CV10
  Top 0.254: J10.TIP 148.93,104.14 154.94,104.14 155.89,103.19 R10.2
CV11
  Top 0.254: J11.TIP 164.17,104.14 170.18,104.14 171.13,103.19 R11.2
CV12
  Top 0.254: J12.TIP 178,103.07 179.07,104.14 185.74,104.14 186.37,103.5 R12.2
CV13
  Top 0.254: J13.TIP 194.65,104.14 200.66,104.14 201.61,103.19 R13.2
CV14
  Top 0.254: J14.TIP 208.48,103.07 209.55,104.14 215.9,104.14 216.85,103.19 R14.2
CV15
  Top 0.254: J15.TIP 223.72,103.07 224.79,104.14 230.5,104.14 232.09,102.55 R15.2
CV16
  Top 0.254: J16.TIP 242.71,102.73 245.11,100.33 R16.2
GND  (via drill 0.35)
  other vias: 189.23,26.67 50.48,13.34 85.09,26.67 129.54,22.86
  pour Bottom: 0,0 249,0 248.69,118.12 arc90 246.15,120.65 2.54,120.65 arc90 0,118.11
  pour Top: 0,-0.32 248.92,-0.32 248.92,118.11 arc90 246.38,120.65 2.54,120.65 arc90 0,118.11
MIDI_OUT
  Top 0.406: R49.2 56.52,5.71 55.71,6.53 45.26,6.53 44.44,5.71 40.01,5.71 38.1,3.81 31.75,3.81 11.11,3.81 10.79,3.81 U$17.1
N$1
  Top 0.254: S1.P2 227.06,5.71 228.6,5.71 229.55,4.76 229.55,3.49 229.87,3.17 240.98,3.17 242.25,4.45 242.25,17.75 JP1.TIP
N$2
  Bottom 0.254: JP1.RING 233.36,10 230.34,10 229.87,9.53 229.24,8.89 229.24,4.5 228.47,3.73 227.65,3.73 226.67,4.71 S1.P1
N$3
  Top 0.254: S1.P2-TA 225.08,5.7 226.47,5.7 227.45,4.71 S1.P1-TB
  Top 0.406: R49.1 219.68,5.71 220.94,6.97 223.8,6.97 S1.P2-TA
N$4
  Top 0.406: R52.1 221.88,2.54 S1.P1-TA
  Bottom 0.254: S1.P1-TA 224.67,4.71 225.65,5.7 227.04,5.7 S1.P2-TB
N$6
  Top 0.254: R38.2 111.76,12.38 R37.2 110.49,12.38 109.86,13.02 109.86,13.97 109.28,14.55 106.74,14.55 106.05,15.24 U3.5
N$7
  Top 0.254: R23.2 R24.2 113.67,15.88 113,15.21 112.8,15.21 112.47,14.89 112.47,13.52 112.29,13.34 110.81,13.34 110.79,13.36 110.58,13.36 110.41,13.52 110.41,14.05 109.22,15.24 U3.10
N$9
  Top 0.254: R36.2 R35.2 89.22,12.38 88.9,12.7 88.9,14.29 88.53,14.66 85.84,14.66 85.26,15.24 U2.5
N$10
  Top 0.254: R21.2 90.81,18.1 92.39,18.1 | 92.39,18.1 R22.2 | 92.39,18.1 92.71,17.78 92.71,15.88 92.05,15.21 91.84,15.21 91.52,14.89 91.52,13.52 91.33,13.34 89.53,13.34 89.31,13.56 89.31,14.46 88.52,15.24 U2.10
N$12
  Top 0.254: R40.2 R39.2 130.81,12.38 130.34,12.85 130.34,14.39 130.18,14.55 127.69,14.55 127,15.24 U4.5
N$13
  Top 0.254: R25.2 R26.2 134.62,15.56 134.28,15.21 133.75,15.21 133.43,14.89 133.43,13.52 133.24,13.34 131.13,13.34 130.81,13.65 130.81,14.92 130.49,15.24 U4.10
N$15
  Top 0.254: R42.2 R41.2 152.09,12.38 152.08,12.38 151.76,12.7 151.76,13.92 151.03,14.66 148.91,14.66 148.7,14.66 148.12,15.24 U5.5
N$16
  Top 0.254: R27.2 R28.2 155.57,15.88 154.91,15.21 154.71,15.21 154.38,14.89 154.38,13.52 154.2,13.34 152.4,13.34 152.17,13.56 152.17,14.09 151.55,14.71 151.23,15.03 151.02,15.24 U5.10
N$18
  Top 0.254: R44.2 R43.2 173.35,12.38 172.72,13.02 172.72,13.92 172.09,14.55 169.6,14.55 168.91,15.24 U6.5
N$19
  Top 0.254: R29.2 R30.2 176.53,16.08 175.5,15.05 175.5,13.58 175.24,13.31 173.48,13.31 173.28,13.52 173.28,14.68 172.72,15.24 U6.10
N$21
  Top 0.254: R46.2 R45.2 193.99,12.38 193.68,12.7 193.68,13.92 193.05,14.55 190.56,14.55 189.87,15.24 U7.5
N$22
  Top 0.254: R31.2 R32.2 197.49,16.51 196.29,15.32 196.29,13.52 196.11,13.34 194.31,13.34 194.23,13.41 194.23,14.36 193.36,15.24 U7.10
N$24
  Top 0.254: R48.2 R47.2 214.95,12.38 214.63,12.7 214.63,13.97 214,14.61 211.46,14.61 210.82,15.24 U8.5
N$25
  Top 0.254: R33.2 R34.2 218.44,15.95 217.7,15.21 217.57,15.21 217.41,15.05 217.41,13.68 217.08,13.36 215.35,13.36 215.19,13.52 215.19,15 214.95,15.24 U8.10
N$27
  Top 0.254: 235.59,5.71 235.59,13.92 234.96,14.55 232.47,14.55 231.78,15.24 U9.5 | R50.2 236.85,5.4 | 236.85,5.4 236.22,5.4 | R51.2 236.85,5.4 | 235.59,5.71 | 236.22,5.4 | 235.59,5.71 235.9,5.4 236.22,5.4
N$28
  Top 0.254: R20.2 R19.2 237.17,21.27 238.37,20.08 238.37,6.7 238.04,6.37 236.31,6.37 236.14,6.53 236.14,14.68 235.59,15.24 U9.10
N$300
  Top 0.254: 81.86,20.26 79.69,20.26 78.42,21.53 78.42,25.72 70.17,33.97 17.81,33.97 14.32,37.47 14.32,96.52 16.83,99.03 R1.1 | U2.2 81.86,20.26 | U2.1 81.86,20.26
N$301
  Top 0.254: R2.1 30.07,99.6 28.69,99.6 28.05,98.96 28.05,37.36 31.03,34.38 79.29,34.38 87.06,26.61 U2.14 U2.13
N$302
  Top 0.254: R3.1 47.31,99.06 44.8,96.55 44.8,38.07 47.27,35.6 83.09,35.6 98.36,20.32 U3.1 U3.2
N$303
  Top 0.254: R4.1 59.05,101.6 58.42,100.97 58.42,97.16 59.22,96.35 59.22,38.25 61.47,36.01 105.28,36.01 108.01,33.28 U3.14 U3.13
N$304
  Top 0.254: R5.1 77.79,99.03 75.28,96.52 75.28,38.33 76.38,37.22 105.79,37.22 107.45,35.56 115.57,35.56 120.02,31.11 120.02,22.86 122.56,20.32 123.51,20.32 | U4.1 123.51,20.32 | U4.2 123.77,20.06 123.51,20.32
N$305
  Top 0.254: R6.1 90.17,101.6 88.9,100.33 88.9,39.05 90.32,37.63 128.42,37.63 131.13,34.92 131.13,20.64 130.81,20.32 U4.14 U4.13
N$306
  Top 0.254: R7.1 108.27,40.64 110.06,38.85 128.93,38.85 139.38,28.39 139.38,21.91 140.97,20.32 U5.1 U5.2
N$307
  Top 0.254: R8.1 120.02,101.6 119.38,100.97 119.38,40.96 121.08,39.26 150.61,39.26 152.08,37.78 152.08,20.64 151.76,20.32 150.18,20.32 | U5.14 150.18,20.32 | U5.13 149.92,20.06 150.18,20.32
N$308
  Top 0.254: R9.1 138.75,46.03 141.11,43.67 151.15,43.67 154.16,40.66 154.16,29.67 163.51,20.32 U6.1 U6.2
N$309
  Top 0.254: R10.1 150.18,101.6 149.86,101.28 149.86,46.99 152.72,44.13 166.28,44.13 168.5,41.91 168.5,28.35 170.88,25.98 U6.14 U6.13
N$310
  Top 0.254: R11.1 169.23,43.44 173.52,39.14 177.97,39.14 181.23,35.88 181.29,35.88 181.29,21.27 182.25,20.32 U7.1 U7.2
N$311
  Top 0.254: R12.1 184.47,87.63 191.45,80.64 191.45,26.99 191.83,26.61 U7.14 U7.13
N$312
  Top 0.254: R13.1 199.71,99.06 197.2,96.55 197.2,25.69 202.56,20.32 U8.1 U8.2
N$313
  Top 0.254: R14.1 211.46,101.6 210.82,100.97 210.82,97.16 215.81,92.17 215.81,21.82 214.31,20.32 213.04,20.32 | U8.14 213.04,20.32 | U8.13 212.78,20.06 213.04,20.32
N$314
  Top 0.254: R15.1 230.19,99.06 227.68,96.55 227.68,22 227.1,21.42 227.1,20.55 227.33,20.32 U9.1 U9.2
N$315
  Top 0.254: R16.1 244.16,91.76 243.84,92.08 243.84,99.38 243.21,100.01 242.25,100.01 241.3,99.06 241.3,96.52 242.1,95.72 242.1,37.89 236.77,32.55 236.77,25.89 235.18,24.3 235.18,20.55 234.95,20.32 U9.14 U9.13
S0
  Top 0.254: U1.10 59.86,12.06 56.02,8.23 44.55,8.23 43.74,7.42 39.3,7.42 37.4,5.51 26.87,5.51 U$17.8
S1
  Top 0.254: U1.11 59.16,10.79 59.11,10.74 56.19,7.82 44.72,7.82 43.91,7.01 39.47,7.01 37.56,5.11 24.74,5.11 U$17.7
S2
  Top 0.254: U1.14 69.85,10.79 69.22,10.16 69.22,7.94 68.69,7.42 44.89,7.42 44.08,6.6 39.64,6.6 37.73,4.7 22.61,4.7 U$17.6
S3
  Top 0.254: 20.47,4.29 20.64,4.29 | 20.64,4.29 37.9,4.29 39.8,6.2 44.24,6.2 45.06,7.01 69.56,7.01 70.17,7.62 70.17,8.89 70.8,9.53 U1.13 | 20.47,4.29 20.64,4.29 | U$17.5 20.47,4.29
SCL  (via drill 0.35)
  Top 0.406: R17.1 44.45,22.54 45.09,23.18 45.1,23.16 D1.A 48.9,20.62 D2.C v48.9,18.41 48.9,16.19 45.48,12.78 JP2.RING
  Bottom 0.254: JP2.RING 45.48,13.89 44.22,15.15 26.44,15.15 20.32,21.27 U$17.19/A5
SDA
  Top 0.406: R18.1 55.88,22.54 55.24,23.18 53.99,23.18 D4.A 53.98,22.55 D3.C 51.44,16.04 53.42,14.05 55.48,11.99 JP2.TIP
  Bottom 0.254: JP2.TIP 55.48,10.16 53.9,11.75 48.26,11.75 44.45,15.56 26.67,15.56 22.86,19.37 U$17.18/A4
W0
  Top 0.254: R35.1 90.49,15.24 89.91,15.82 80.07,15.82 79.69,16.19 79.69,17.46 80.01,17.78 | U$1.2 13.91,37.3 17.68,33.53 70.04,33.53 78.02,25.55 78.02,19.77 80.01,17.78 | U2.3 80.01,17.78
W1
  Top 0.254: 88.9,19.68 89.22,20 R21.1 | 88.9,19.68 88.9,18.1 88.58,17.78 U2.12 | 88.9,19.68 88.9,25.4 79.52,34.78 31.43,34.78 29.15,37.07 U$2.2
W2
  Top 0.254: R37.1 111.44,15.56 111.12,15.88 101.6,15.88 100.97,16.51 100.97,17.14 | 100.97,17.14 100.97,17.46 101.28,17.78 U3.3 | U$3.2 44.39,37.84 47.04,35.19 82.92,35.19 100.97,17.14
W3
  Top 0.254: U$4.2 59.63,38.42 61.64,36.41 105.45,36.41 107.25,34.61 108.58,34.61 111.44,31.75 R23.1 110.17,20 109.86,19.68 109.86,18.1 109.54,17.78 U3.12
W4
  Top 0.254: R39.1 132.4,15.24 131.76,15.88 122.24,15.88 121.92,16.19 121.92,17.46 122.08,17.62 122.24,17.78 122.56,17.78 | U$5.2 74.87,38.16 76.21,36.82 105.62,36.82 107.42,35.01 114.21,35.01 115.57,33.66 115.57,22.23 120.02,17.78 122.56,17.78 | U4.3 122.56,17.78
W5
  Top 0.254: U$6.2 89.31,97.7 89.31,39.22 90.49,38.04 128.59,38.04 131.53,35.09 131.53,21.82 132.4,20.95 R25.1 131.13,20 130.81,19.68 130.81,18.1 130.49,17.78 U4.12
W6
  Top 0.254: R41.1 153.35,15.24 152.72,15.88 143.51,15.88 143.19,16.19 143.19,17.46 143.51,17.78 U5.3 139.06,17.78 135.57,21.27 135.57,31.63 128.76,38.44 106.97,38.44 105.35,40.06 U$7.2
W7
  Top 0.254: U$8.2 120.65,98.44 120.65,45.72 123.51,42.86 150.81,42.86 153.35,40.32 R27.1 152.4,20 151.76,19.37 151.76,18.41 151.13,17.78 U5.12
W8
  Top 0.254: 164.78,17.78 164.47,17.78 | 164.47,17.78 163.83,17.14 | 163.83,17.14 163.83,16.19 164.15,15.88 173.67,15.88 174.31,15.24 R43.1 | 164.47,17.78 164.78,17.78 | 164.47,17.78 164.29,17.78 153.76,28.31 153.76,40.49 150.98,43.27 138.66,43.27 135.83,46.1 U$9.2 | 163.83,17.14 164.47,17.78 | 164.47,17.78 164.78,17.78 | U6.3 164.78,17.78
W9
  Top 0.254: U$10.2 151.07,98.36 150.27,97.56 150.27,47.16 152.89,44.54 166.45,44.54 168.91,42.08 168.91,30.16 174.31,24.77 R29.1 173.04,20 172.72,19.68 172.72,18.41 172.09,17.78 U6.12
W10
  Top 0.254: 186.06,17.78 185.42,17.78 185.1,17.46 185.1,16.19 185.42,15.88 194.63,15.88 195.26,15.24 R45.1 | 186.06,17.78 183.2,17.78 180.89,20.09 180.89,35.65 177.8,38.73 173.35,38.73 168.75,43.34 168.75,95.98 168.72,96.01 166.31,98.42 U$11.2 | U7.3 186.06,17.78
W11
  Top 0.254: 193.04,17.78 | 193.04,17.78 193.36,17.78 193.68,18.1 193.68,19.68 193.99,20 R31.1 195.26,26.67 195.9,27.3 195.9,46.99 191.86,51.03 191.86,80.87 185.42,87.31 185.42,102.55 184.78,103.19 183.2,103.19 181.55,101.54 U$12.2 | U7.12 193.04,17.78
W12
  Top 0.254: R47.1 216.22,15.24 215.58,15.88 206.06,15.88 205.74,16.19 205.74,17.46 206.06,17.78 206.38,17.78 | 206.38,17.78 204.47,17.78 196.79,25.46 U$13.2 | U8.3 206.38,17.78
W13
  Top 0.254: R33.1 214.95,20 214.63,19.68 214.63,18.41 214,17.78 U8.12 | R33.1 | U$14.2 212.03,98.42 216.22,94.24 R33.1
W14
  Top 0.254: R50.1 237.17,14.92 236.22,15.88 227.01,15.88 226.69,16.19 226.69,16.83 226.69,18.1 | U$15.2 227.27,38.36 227.27,22.16 226.69,21.59 226.69,18.1 | 226.69,18.1 227.01,17.78 U9.3
W15
  Top 0.254: U$16.2 242.51,37.72 237.17,32.38 R19.1 235.91,24.45 235.9,24.45 235.59,24.13 235.59,18.1 235.27,17.78 U9.12

### Text on the board
tNames: MIDI | Teensy 3.2 | SCL | SDA | 74HC4067 | 16 | (Korg, Makenoise, etc) | K | Tip is Out / Ring is +5V | II | K | A | I2C: Tip SDA, Ring SCL / DO NOT HOT PLUG | (Arturia, Novation, etc) | A | Tip is +5V / Ring is Out
bNames: 16 | Sean Hellfritsch / Brian Crabtree / Tom Armitage / Brendon Cassidy | v1.31 | CC-BY-SA 4.0 | Creative Commons / Attribution / ShareAlike | (Korg, Makenoise, etc) | Tip is Out / Ring is +5V | K | K | A | (Arturia, Novation, etc) | Tip is +5V / Ring is Out | A